# Altium schematic sheet 01.SchDoc
size A4
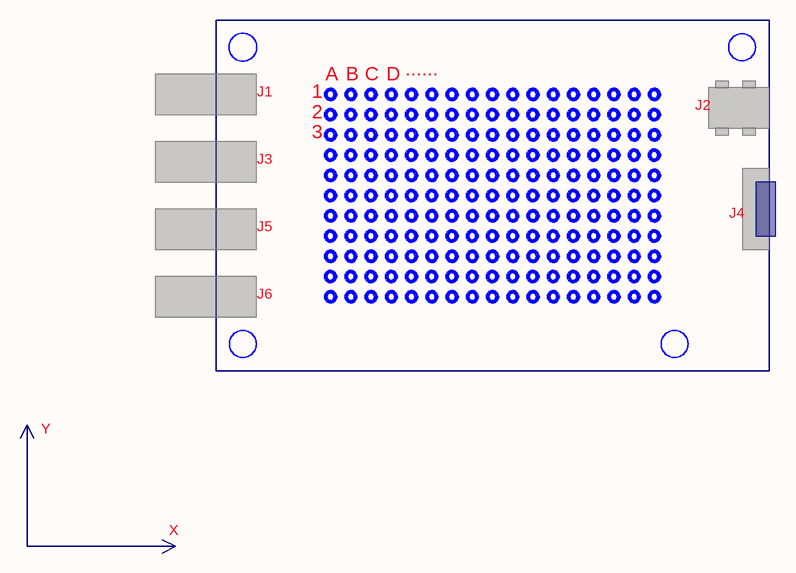
[diagram p0: 01.SchDoc]

## Notes on the sheet
- A
- B
- C
- D
- ......
- J1
- 1
- 2
- 3
- J2
- J3
- J4
- J5
- J6
- Y
- X